# EAGLE design H2AR30 (EAGLE 9.6.2)

## Sheet 1 of 2
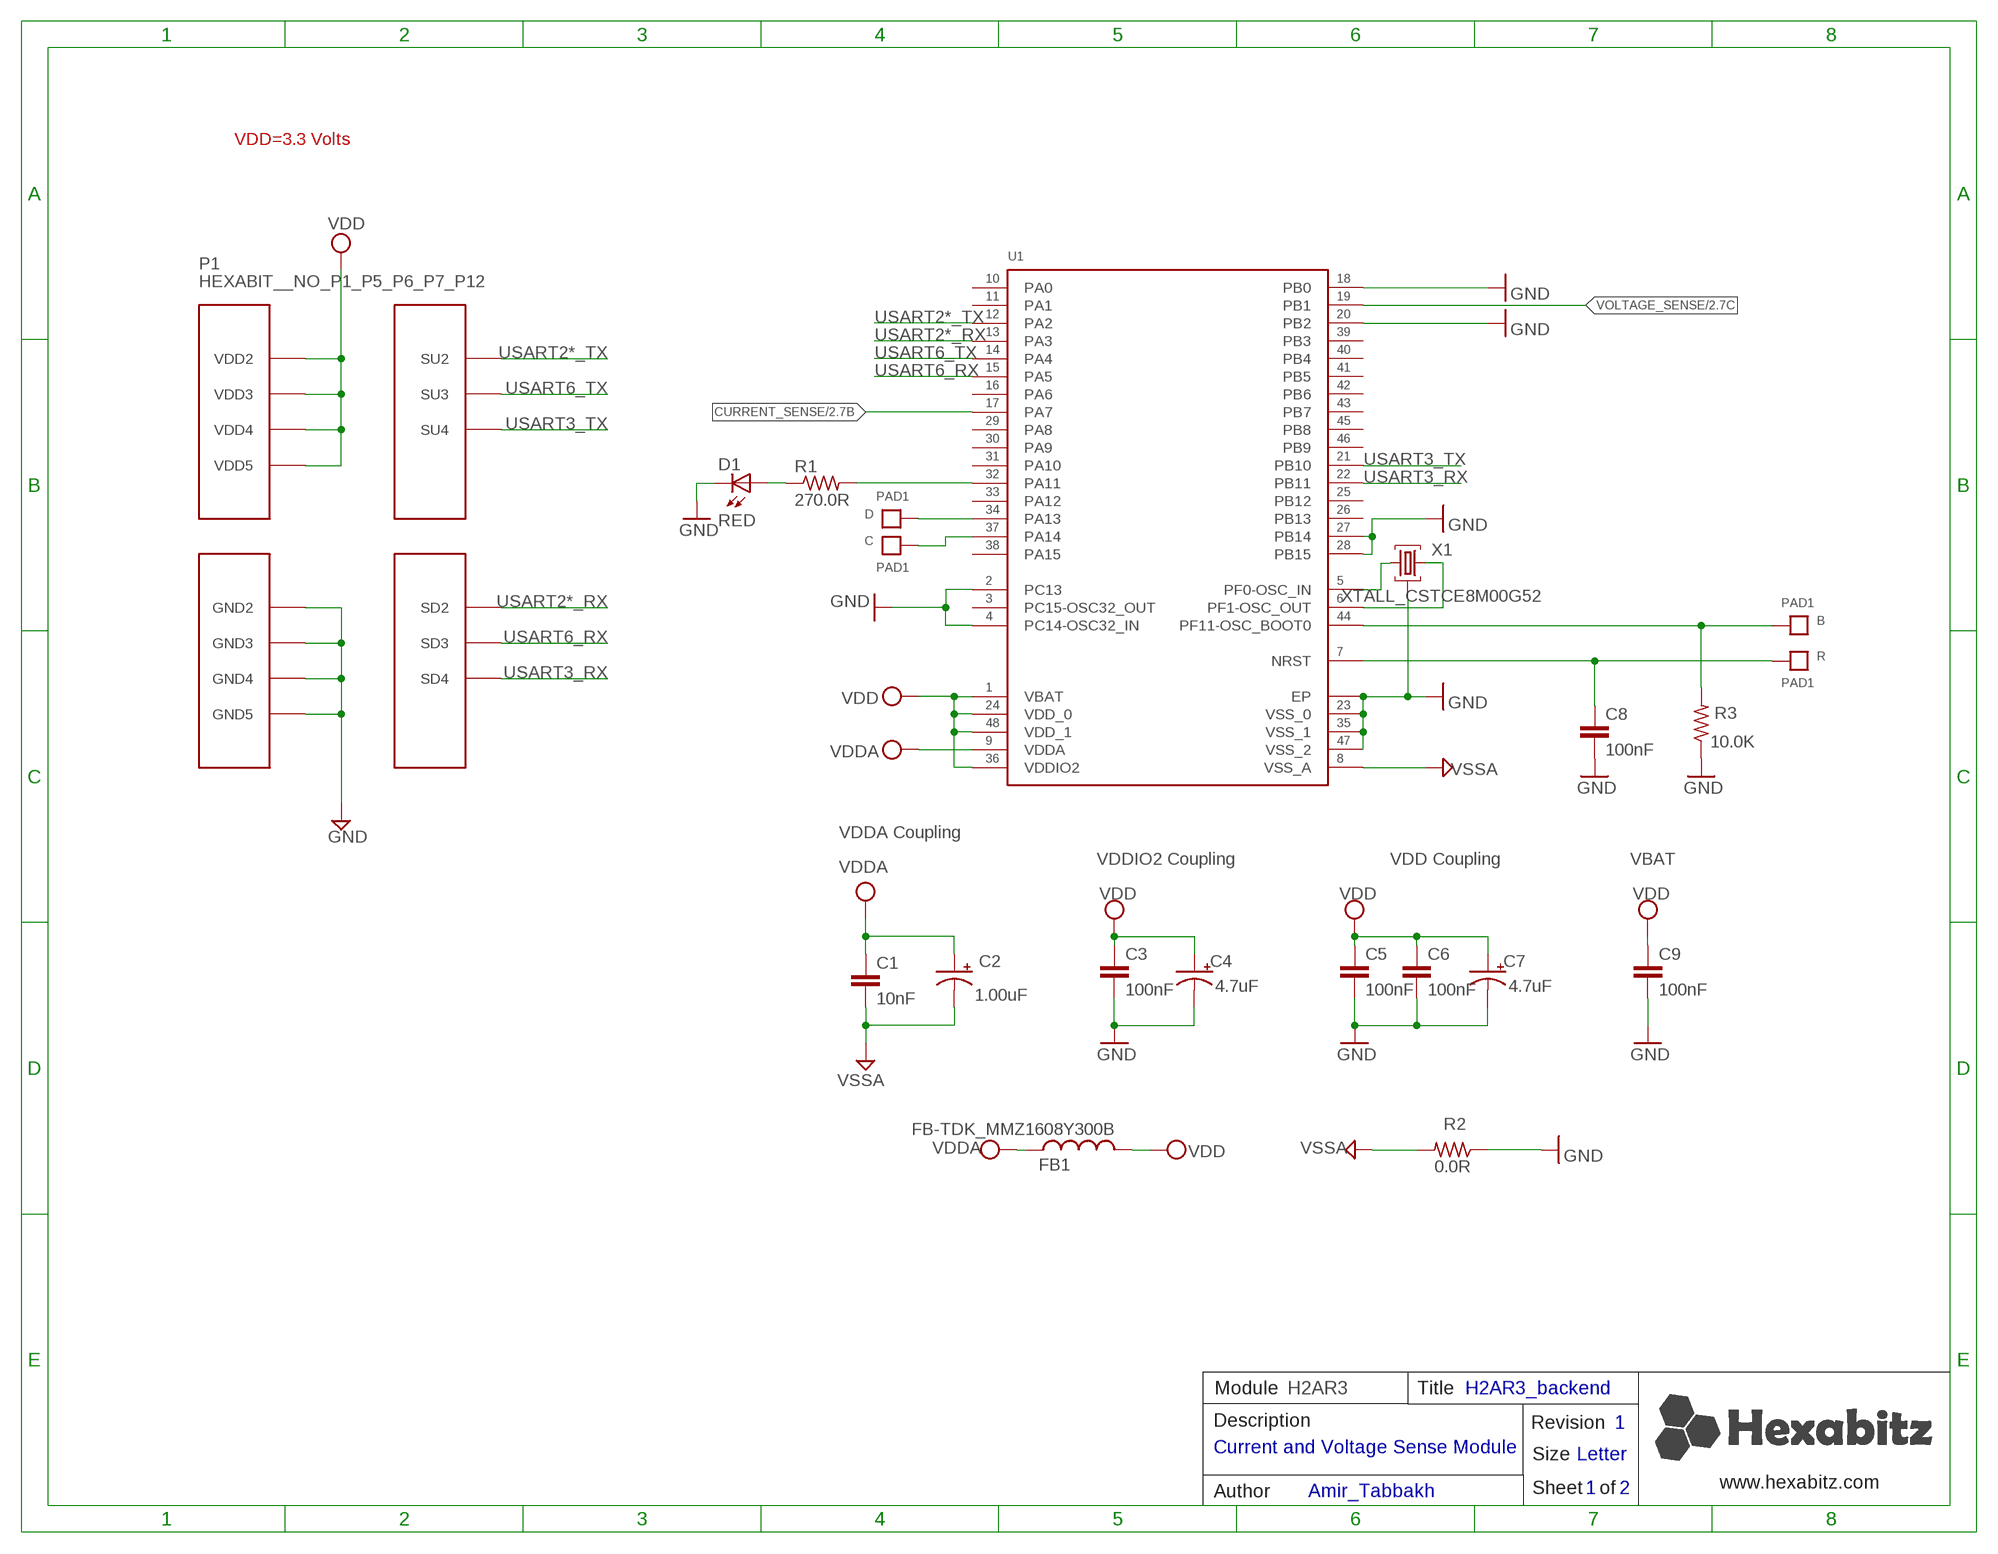
[diagram p0: schematic, sheet 1]

### Parts
B  PAD1  [PAD1]
C  PAD1  [PAD1]
C1  10nF  C-0603  [C-0603]
C2  1.00uF  C-0805-POL  [C-0805-POL]
C3  100nF  C-0603  [C-0603]
C4  4.7uF  C-0805-POL  [C-0805-POL]
C5  100nF  C-0603  [C-0603]
C6  100nF  C-0603  [C-0603]
C7  4.7uF  C-0805-POL  [C-0805-POL]
C8  100nF  C-0603  [C-0603]
C9  100nF  C-0603  [C-0603]
D  PAD1  [PAD1]
D1  RED  VLMS1300-GS08  [VLMS1300-GS08]
FB1  FB-TDK_MMZ1608Y300B  [FB-TDK_MMZ1608Y300B]
P1  HEXABIT__NO_P1_P5_P6_P7_P12  [HEXABIT_17.32_NO_P1_P6_P5_P7_P12]
R  PAD1  [PAD1]
R1  270.0R  R-0603  [R-0603]
R2  0.0R  R-0603  [R-0603]
R3  10.0K  R-0603  [R-0603]
U1  STM32F091CBU6  [STM32F091CBU6]
X1  XTALL_CSTCE8M00G52  [XTALL_CSTCE8M00G52]

### Nets
AGND: C1.2 C2.2(-) R2.2 U1.P$8(VSS_A) ; supply symbol labelled VSSA ; also sheet 2
B1: B.P$1 B.P$2 R3.2 U1.P$44(PF11-OSC_BOOT0)
CURRENT_SENSE: U1.P$17(PA7) ; also sheet 2
GND: C3.2 C4.2(-) C5.2 C6.2 C7.2(-) C8.2 C9.2 D1.C P1.PAD_PD8(GND2) P1.PAD_PD9(GND3) P1.PAD_PD10(GND4) P1.PAD_PD11(GND5) R2.1 R3.1 U1.EP U1.P$2(PC13) U1.P$3(PC14-OSC32_IN) U1.P$18(PB0) U1.P$20(PB2) U1.P$23(VSS_0) U1.P$27(PB14) U1.P$28(PB15) U1.P$35(VSS_1) U1.P$47(VSS_2) X1.P$2
N$3: R1.2 U1.P$32(PA11)
N$4: D1.A R1.1
N$5: U1.P$5(PF0-OSC_IN) X1.P$1
N$6: U1.P$6(PF1-OSC_OUT) X1.P$3
N$7: D.P$1 D.P$2 U1.P$34(PA13)
N$9: C.P$1 C.P$2 U1.P$37(PA14)
R1: C8.1 R.P$1 R.P$2 U1.P$7(NRST)
USART2*_RX: P1.PAD_PD2(SD2) U1.P$13(PA3)
USART2*_TX: P1.PAD_PU2(SU2) U1.P$12(PA2)
USART3_RX: P1.PAD_PD4(SD4) U1.P$22(PB11)
USART3_TX: P1.PAD_PU4(SU4) U1.P$21(PB10)
USART6_RX: P1.PAD_PD3(SD3) U1.P$15(PA5)
USART6_TX: P1.PAD_PU3(SU3) U1.P$14(PA4)
VCC: C1.1 C2.1(+) FB1.1 U1.P$9(VDDA) ; supply symbol labelled VDDA ; also sheet 2
VDD: C3.1 C4.1(+) C5.1 C6.1 C7.1(+) C9.1 FB1.2 P1.PAD_PU8(VDD2) P1.PAD_PU9(VDD3) P1.PAD_PU10(VDD4) P1.PAD_PU11(VDD5) U1.P$1(VBAT) U1.P$24(VDD_0) U1.P$36(VDDIO2) U1.P$48(VDD_1)
VOLTAGE_SENSE: U1.P$19(PB1) ; also sheet 2
Unconnected: U1.P$4(PC15-OSC32_OUT) U1.P$10(PA0) U1.P$11(PA1) U1.P$16(PA6) U1.P$25(PB12) U1.P$26(PB13) U1.P$29(PA8) U1.P$30(PA9) U1.P$31(PA10) U1.P$33(PA12) U1.P$38(PA15) U1.P$39(PB3) U1.P$40(PB4) U1.P$41(PB5) U1.P$42(PB6) U1.P$43(PB7) U1.P$45(PB8) U1.P$46(PB9)

### Notes on the sheet
- VDD=3.3 Volts
- VDDA Coupling
- VDDIO2 Coupling | VDD Coupling | VBAT
- Module | H2AR3 | Title | H2AR3_backend
- Description | Revision | 1
- Current and Voltage Sense Module
- Size | Letter
- www.hexabitz.com
- Author | Amir_Tabbakh | Sheet   of | 1 | 2
- C:/Users/Admin/Desktop/logodraft.bmp

## Sheet 2 of 2
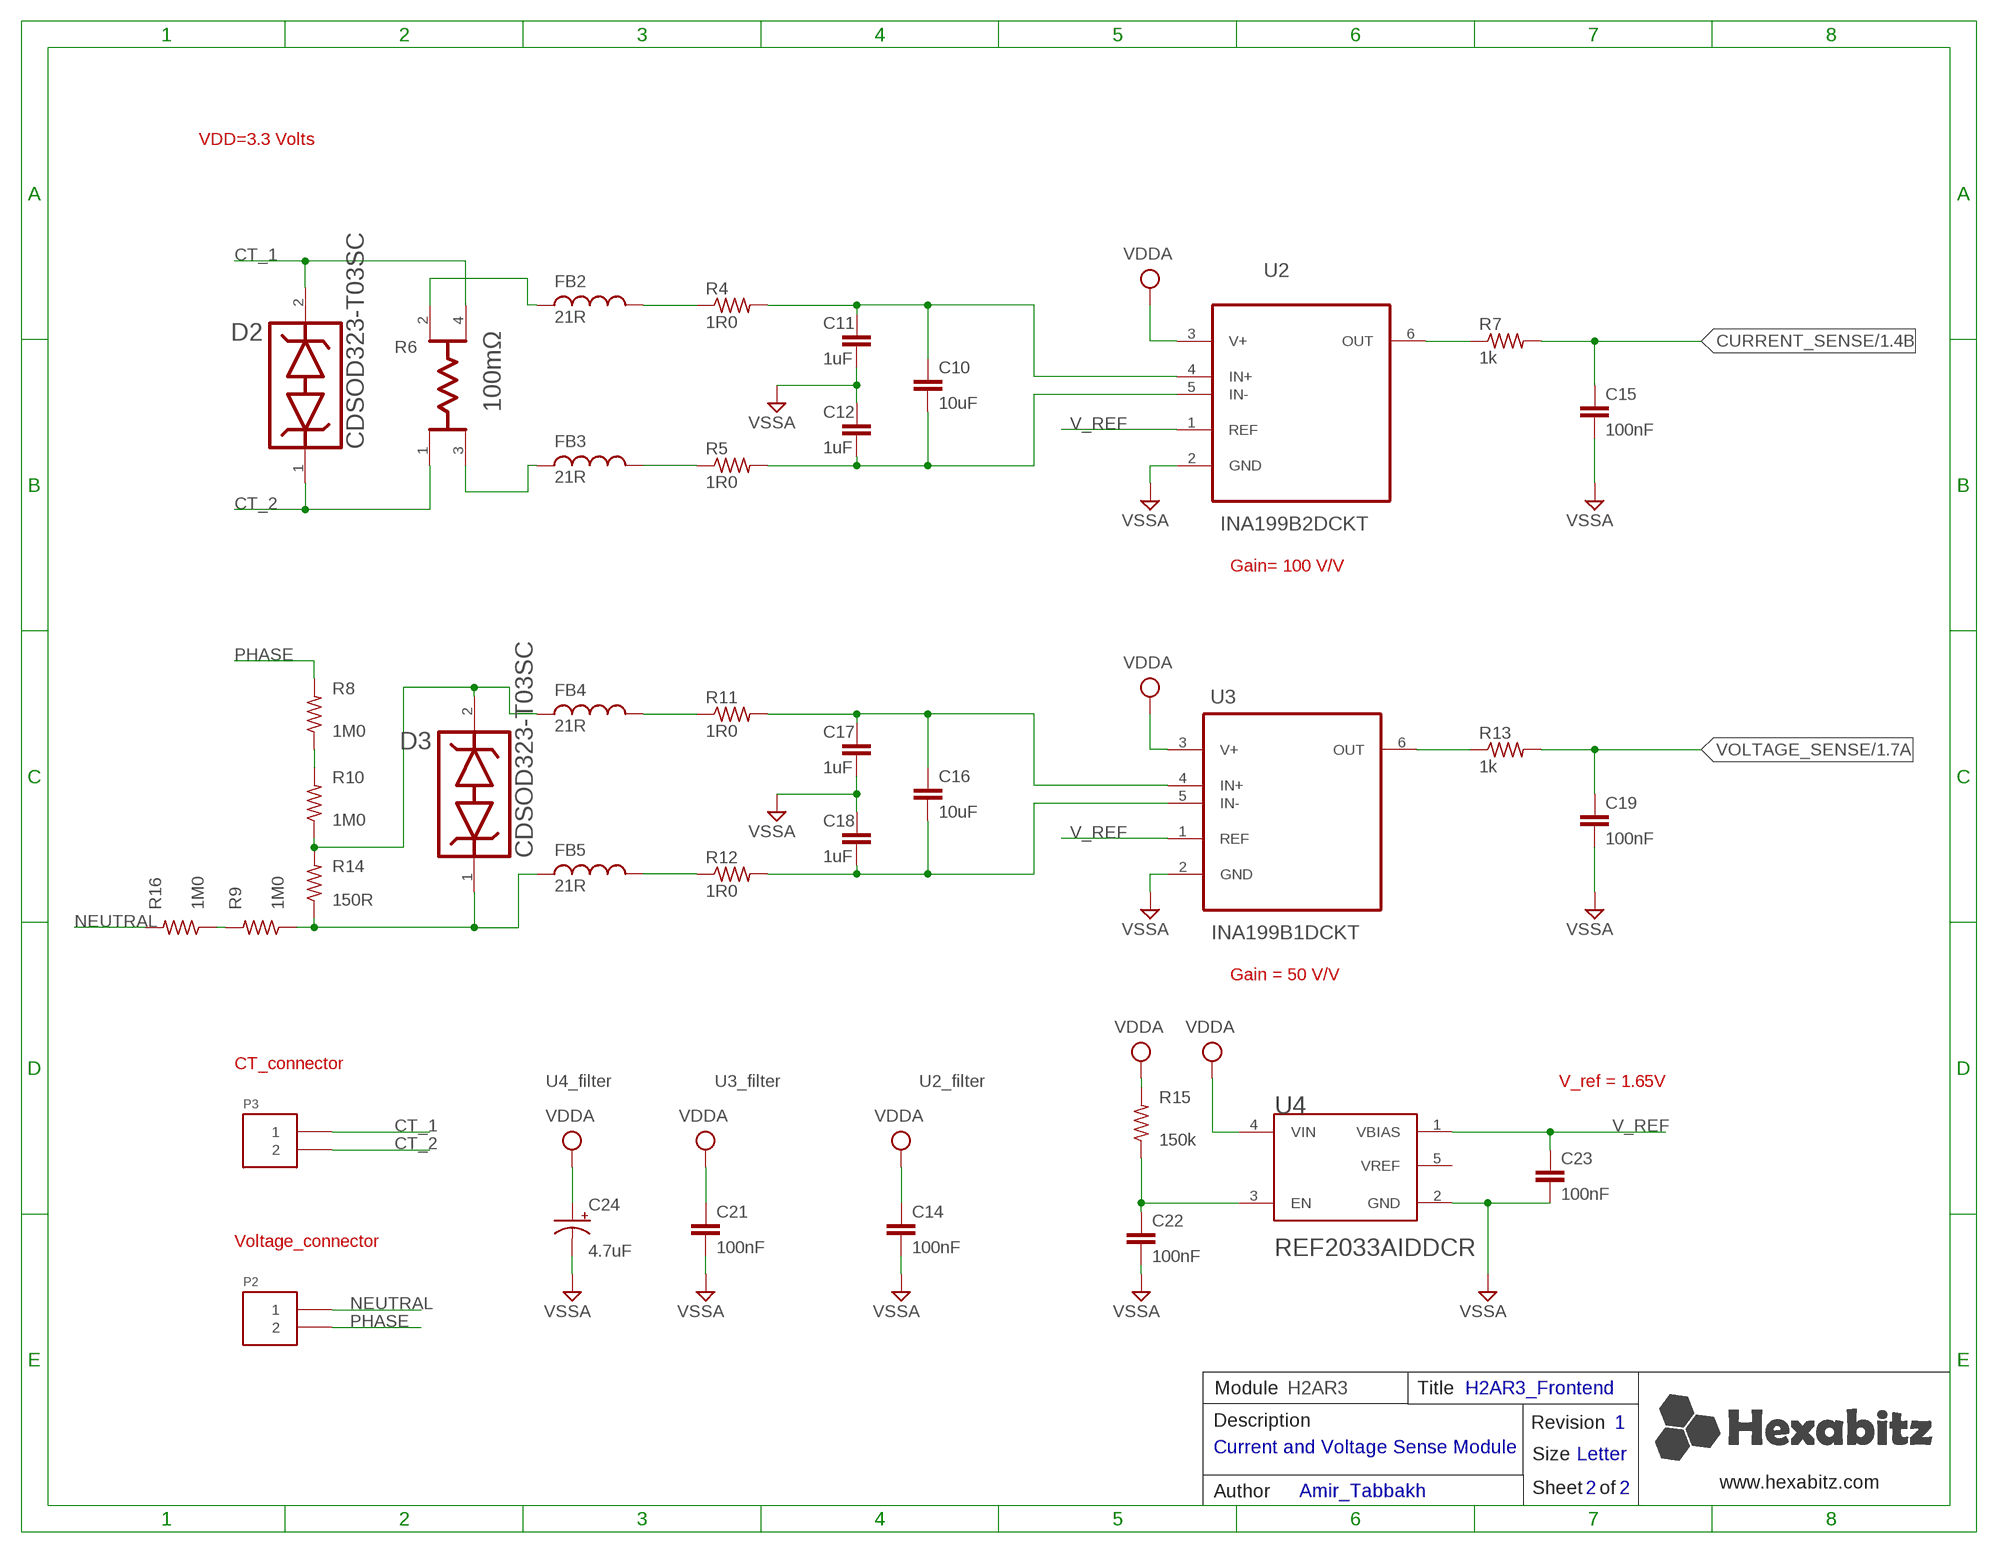
[diagram p1: schematic, sheet 2]

### Parts
C10  10uF  C-0603  [C-0603]
C11  1uF  C-0603  [C-0603]
C12  1uF  C-0603  [C-0603]
C14  100nF  C-0603  [C-0603]
C15  100nF  C-0603  [C-0603]
C16  10uF  C-0603  [C-0603]
C17  1uF  C-0603  [C-0603]
C18  1uF  C-0603  [C-0603]
C19  100nF  C-0603  [C-0603]
C21  100nF  C-0603  [C-0603]
C22  100nF  C-0603  [C-0603]
C23  100nF  C-0603  [C-0603]
C24  4.7uF  C-0805-POL  [C-0805-POL]
D2  BOURNS_CDSOD323-T03SCBOURNS_CDSOD323-T03SC_0_0  [BOURNS_CDSOD323-T03SC_0]
D3  BOURNS_CDSOD323-T03SCBOURNS_CDSOD323-T03SC_0_0  [BOURNS_CDSOD323-T03SC_0]
FB2  21R  FB-0805  [FB-0805]
FB3  21R  FB-0805  [FB-0805]
FB4  21R  FB-0805  [FB-0805]
FB5  21R  FB-0805  [FB-0805]
P2  1546111-2  [1546111-2]
P3  1546111-2  [1546111-2]
R4  1R0  R-0603  [R-0603]
R5  1R0  R-0603  [R-0603]
R6  VISHAY_Y14870R10000B9RVISHAY_Y14870R10000B9R_0_0  [VISHAY_Y14870R10000B9R_0]
R7  1k  R-0603  [R-0603]
R8  1M0  R_1206R1206  [R1206]
R9  1M0  R_1206R1206  [R1206]
R10  1M0  R_1206R1206  [R1206]
R11  1R0  R-0603  [R-0603]
R12  1R0  R-0603  [R-0603]
R13  1k  R-0603  [R-0603]
R14  150R  R_1206R1206  [R1206]
R15  150k  R-0603  [R-0603]
R16  1M0  R_1206R1206  [R1206]
U2  INA199B2DCKT  [SOT65P210X110-6N]
U3  INA199B1DCKT  [SOT65P210X110-6N]
U4  TEXAS_INSTRUMENTS_REF2033AIDDCRTEXAS_INSTRUMENTS_REF2033AIDDCR_0_2  [TEXAS_INSTRUMENTS_REF2033AIDDCR_2]

### Nets
AGND: C11.1 C12.2 C14.2 C15.2 C17.1 C18.2 C19.2 C21.2 C22.2 C23.2 C24.2(-) U2.2(GND) U3.2(GND) U4.2(GND) ; supply symbol labelled VSSA ; also sheet 1
CT_1: D2.2 P3.1 R6.4(I2)
CT_2: D2.1 P3.2 R6.1(I1)
CURRENT_N: FB2.1 R6.2(E2)
CURRENT_P: FB3.1 R6.3(E1)
CURRENT_SENSE: C15.1 R7.2 ; also sheet 1
N$2: C10.1 C11.2 R4.2 U2.4(IN+)
N$8: C10.2 C12.1 R5.2 U2.5(IN-)
N$10: R9.2 R16.1
N$11: FB2.2 R4.1
N$12: FB3.2 R5.1
N$13: R8.1 R10.2
N$15: R7.1 U2.6(OUT)
N$16: C22.1 R15.1 U4.3(EN)
N$17: C16.1 C17.2 R11.2 U3.4(IN+)
N$18: C16.2 C18.1 R12.2 U3.5(IN-)
N$19: FB4.2 R11.1
N$20: FB5.2 R12.1
N$21: D3.2 FB4.1 R10.1 R14.2
N$22: D3.1 FB5.1 R9.1 R14.1
N$23: R13.1 U3.6(OUT)
NEUTRAL: P2.1 R16.2
PHASE: P2.2 R8.2
V_REF: C23.1 U2.1(REF) U3.1(REF) U4.1(VBIAS)
VCC: C14.1 C21.1 C24.1(+) R15.2 U2.3(V+) U3.3(V+) U4.4(VIN) ; supply symbol labelled VDDA ; also sheet 1
VOLTAGE_SENSE: C19.1 R13.2 ; also sheet 1

### Notes on the sheet
- VDD=3.3 Volts
- Gain= 100 V/V
- Gain = 50 V/V
- CT_connector
- U4_filter | U3_filter | U2_filter | V_ref = 1.65V
- Voltage_connector
- Module | H2AR3 | Title | H2AR3_Frontend
- Description | Revision | 1
- Current and Voltage Sense Module
- Size | Letter
- www.hexabitz.com
- Author | Amir_Tabbakh | Sheet   of | 2 | 2

## Power pins joined to a net without a drawn wire
VREF: U4.5(VREF)

## Library data of the parts
B C D R = HEXABITZ_CONNECTION_PARTS:PAD1
C1 = HEXABITZ_RCLS:C-0603: CAP CER 10% X7R 0603; CAPACITANCE: 10nF; MFN: KEMET; MPN: C0603C103K5RACTU; OCTOPART_URL: https://octopart.com/c0603c103k5ractu-kemet-133094?r=sp&s=R_iPBxLnSmGqhkU2rIMFpg; TOLERANCE: 10%; VOLTAGE_RATING: 50V
C2 = HEXABITZ_RCLS:C-0805-POL: Cap Tant Solid SMD 2012; CAPACITANCE: 1.00uF; MFN: Yageo; MPN: CC0805KKX7R7BB105; OCTOPART_URL: https://octopart.com/cc0805kkx7r7bb105-yageo-8376555?r=sp&s=YKl1wwtkROau_X5nniH2ig; TOLERANCE: 10%; VOLTAGE_RATING: 16V
C3 C6 C8 C14 C15 C19 C21-C23 = HEXABITZ_RCLS:C-0603: CAP CER 10% X7R 0603; CAPACITANCE: 100nF; MFN: KEMET; MPN: C0603C104K8RACTU; OCTOPART_URL: https://octopart.com/c0603c104k8ractu-kemet-145075?r=sp&s=9bS9ASSwSEqMCE9KBEQZ0g; TOLERANCE: 10%; VOLTAGE_RATING: 10V
C4 C7 C24 = HEXABITZ_RCLS:C-0805-POL: Cap Tant Solid SMD 2012; CAPACITANCE: 4.7uF; MFN: Murata; MPN: GRM21BC81E475KA12L; OCTOPART_URL: https://octopart.com/grm21bc81e475ka12l-murata-10331911?r=sp&s=RY3qZSD8T6mG6TC9CHI5qQ; TOLERANCE: 10%; VOLTAGE_RATING: 25V
C5 = HEXABITZ_RCLS:C-0603: CAP CER 10% X7R 0603; CAPACITANCE: 100nF; MFN: KEMET; MPN: C0603C104K8RACTU; OCTOPART_URL: https://octopart.com/c0603c104k8ractu-kemet-145075?r=sp&s=9bS9ASSwSEqMCE9KBEQZ0g; TOLERANCE: 10%; VOLTAGE_RATING: 10
C9 = HEXABITZ_RCLS:C-0603: CAP CER 10% X7R 0603; CAPACITANCE: 100nF; MFN: KEMET; MPN: C0603C104K8RACTU; OCTOPART_URL: https://octopart.com/c0603c104k8ractu-kemet-145075?r=sp&s=9bS9ASSwSEqMCE9KBEQZ0g; TOLERANCE: 10V; VOLTAGE_RATING: 10%
C10 = HEXABITZ_RCLS:C-0603: CAP CER 10% X7R 0603; CAPACITANCE: 10uF; MFN: KEMET; MPN: C0603C106M9PACTU; OCTOPART_URL: https://octopart.com/c0603c106m9pactu-kemet-8375727?r=sp; VOLTAGE_RATING: 6.3v
C11 C12 C17 C18 = HEXABITZ_RCLS:C-0603: CAP CER 10% X7R 0603; CAPACITANCE: 1uF; MFN: KEMET; MPN: C0603C105K8RACTU; OCTOPART_URL: https://octopart.com/c0603c105k8ractu-kemet-12595642?r=sp; TOLERANCE: 10%; VOLTAGE_RATING: 10v
C16 = HEXABITZ_RCLS:C-0603: CAP CER 10% X7R 0603; CAPACITANCE: 10uF; MFN: KEMET; MPN: C0603C106M9PACTU; OCTOPART_URL: https://octopart.com/c0603c106m9pactu-kemet-8375727?r=sp; TOLERANCE: 20%; VOLTAGE_RATING: 6.3V
D1 = HEXABITZ_USER_INTERFACE_PARTS:VLMS1300-GS08: Red 0603 130° Clear 54 mcd 2 V Surface Mount ChipLED ; Octopart Url : http://octopart.com/vlms1300-gs08-vishay-21709201; MFN: Vishay; MPN: VLMS1300-GS08; OCTOPART_URL: https://octopart.com/vlms1300-gs08-vishay-21709201?r=sp&s=_gcP4_q8T1SC6PJQPTQ9yA
D2 D3 = HEXABITZ_RCLS:BOURNS_CDSOD323-T03SC: CDSOD323-TxxSC - TVS Diode Series; DESCRIPTION: Dio Tvs Vwm 03V 500W Bidir Sod323 / Tape & Reel - 7" Reel; MFN: Bourns; MPN: CDSOD323-T03SC; OCTOPART_URL: https://octopart.com/cdsod323-t03sc-bourns-10487153?r=sp
FB1 = HEXABITZ_RCLS:FB-TDK_MMZ1608Y300B: Ferrite Beads Multi-Layer 30Ohm 25% 100MHz 1.5A 50mOhm DCR 0603; MFN: TDK; MPN: MMZ1608Y300B; OCTOPART_URL: https://octopart.com/mmz1608y300b-tdk-368280?r=sp&s=cd9_2ZEqQ9q9UNBuQgHAiA
FB2-FB5 = HEXABITZ_RCLS:FB-0805: Ferrite Beads Multi-Layer 0805; MFN: Taiyo Yuden; MPN: FBMJ2125HM210NT; OCTOPART_URL: https://octopart.com/fbmj2125hm210nt-taiyo+yuden-368424?r=sp
P1 = hexabitz_connectors:HEXABIT_?_NO_P1_P5_P6_P7_P12: Hexabitz Hexagon Module Connector Hexagon side length = 18.00mm.
P2 P3 = HEXABITZ_CONNECTION_PARTS:1546111-2: Conn Shrouded Header HDR 2 POS 5.08mm Solder ST Thru-Hole; MFN: TE Connectivity; MPN: 1546111-2; OCTOPART_URL: https://octopart.com/1546111-2-te+connectivity-40393355
R1 = HEXABITZ_RCLS:R-0603: Thick Film Resistors - SMD 0603; MFN: Yageo; MPN: RC0603FR-07270RL; OCTOPART_URL: https://octopart.com/search?q=RC0603FR-07270RL&start=0; RESISTANCE: 270.0 Ohm; TOLERANCE: 5%
R2 = HEXABITZ_RCLS:R-0603: Thick Film Resistors - SMD 0603; MFN: Yageo; MPN: RC0603JR-070RL; OCTOPART_URL: https://octopart.com/rc0603jr-070rl-yageo-1241539?r=sp&s=X2NteqRjRNWrnx42Y0aliA; RESISTANCE: 0.0 Ohm
R3 = HEXABITZ_RCLS:R-0603: Thick Film Resistors - SMD 0603; MFN: Yageo; MPN: RC0603JR-0710KL; OCTOPART_URL: https://octopart.com/search?q=RC0603JR-0710KL&start=0; RESISTANCE: 10.0K Ohm; TOLERANCE: 5%
R4 R5 R11 R12 = HEXABITZ_RCLS:R-0603: Thick Film Resistors - SMD 0603; MFN: Vishay; MPN: CRCW06031R00FKEA; OCTOPART_URL: https://octopart.com/crcw06031r00fkea-vishay-39713722?r=sp&s=biXSlGylTBiwPOCcABx_kA; RESISTANCE: 1; TOLERANCE: 1%
R6 = HEXABITZ_RCLS:VISHAY_Y14870R10000B9R: RES 0.1 OHM 0.1% 1W 2512; DESCRIPTION: Res Metal Strip 2512 100m Ohm 0.1% 1W ±15ppm/°C Molded SMD T/R; MFN: Vishay Precision Group; MPN: Y14870R10000B9R; OCTOPART_URL: https://octopart.com/y14870r10000b9r-vishay+precision+group-20188347?r=sp; POWER_RATING: 1W; RESISTANCE: 100mΩ
R7 R13 = HEXABITZ_RCLS:R-0603: Thick Film Resistors - SMD 0603; MFN: Yageo; MPN: RC0603JR-071KL; OCTOPART_URL: https://octopart.com/rc0603jr-071kl-yageo-55402888?r=sp; RESISTANCE: 1K; TOLERANCE: 5%
R8-R10 R16 = HEXABITZ_RCLS:R_1206: RESISTOR, American symbol; MFN: Yageo; MPN: RT1206BRD071ML; OCTOPART_URL: https://octopart.com/rt1206brd071ml-yageo-1262221?r=sp
R14 = HEXABITZ_RCLS:R_1206: RESISTOR, American symbol; MFN: Panasonic; MPN: ERA-8AEB151V; OCTOPART_URL: https://octopart.com/era-8aeb151v-panasonic-55477439?r=sp
R15 = HEXABITZ_RCLS:R-0603: Thick Film Resistors - SMD 0603; MFN: Vishay; MPN: CRCW0603150KFKEA; OCTOPART_URL: https://octopart.com/crcw0603150kfkea-vishay-39455816?r=sp; RESISTANCE: 150K; TOLERANCE: 1%
U1 = HEXABITZ_ICs:STM32F091CBU6: Description : ARM-based 32-bit MCU, CAN, 12 timers, ADC, DAC & Comm. Interface, 2 to 3.6 V, -40 to 85 degC, 48-Pin UFQFPN, RoHS, Tray ;Parameter : Ciiva URL : https://ciiva.com/part/STM32F091CBU6-20240708, CiivaID : 20240708, Clock Speed : 48000000.0 Hz, Lifecycle Status : Active, Mounting Style : Surface Mount, Number of Pins : 48, Octopart Url : https://octopart.com/stm32f091cbu6-stmicroelectronics-51988677, OctopartID : 5f4f955c32ec8088, RAM Memory Size : 32768 B, REACH SVHC Compliance : No SVHC, RoHS : Compliant,; MFN: STMicroelectronics; MPN: STM32F091CBU6; OCTOPART_URL: https://octopart.com/stm32f091cbu6-stmicroelectronics-51988677?r=sp&s=bU6fpgsrTZOxHyt7jkfh3w
U2 = HEXABITZ_ICs:INA199B2DCKT: CURRENT SHUNT MONITOR; DESCRIPTION: 26V, bi-directional current sense amplifier 6-SC70 -40 to 125; MFN: Texas Instruments; MPN: INA199B2DCKT; OCTOPART_URL: https://octopart.com/ina199b2dckt-texas+instruments-24258237?r=sp
U3 = HEXABITZ_ICs:INA199B1DCKT: CURRENT SHUNT MONITOR; DESCRIPTION: 26V, bi-directional current sense amplifier 6-SC70 -40 to 125; MFN: Texas Instruments; MPN: INA199B1DCKT; OCTOPART_URL: https://octopart.com/ina199b1dckt-texas+instruments-24258235?r=sp
U4 = HEXABITZ_ICs:TEXAS_INSTRUMENTS_REF2033AIDDCR: V-Ref Precision 3.3V 20mA 5-Pin TSOT-23 T/R; DESCRIPTION: Low-Drift, Low-Power, Dual-Output Vref and Vref/2 Voltage Reference 5-SOT-23-THIN -40 to 125; MFN: Texas Instruments; MPN: REF2033AIDDCR; OCTOPART_URL: https://octopart.com/ref2033aiddcr-texas+instruments-46921199?r=sp; OUTPUT_VOLTAGE: 1.65/3.3V
X1 = HEXABITZ_OTHER_PARTS:XTALL_CSTCE8M00G52: MURATA CSTCE8M00G52-R0 RESONATOR, SMD, 8MHZ ; Octopart Url : https://octopart.com/cstce8m00g52-r0-murata-7145559; MFN: Murata; MPN: CSTCE8M00G52Z-R0; OCTOPART_URL: https://octopart.com/cstce8m00g52z-r0-murata-17755941?r=sp&s=JDnNJnrHQhyS8Zk4ofFWXw

## Net classes
0 default: clearance 0.205 mm

## Board
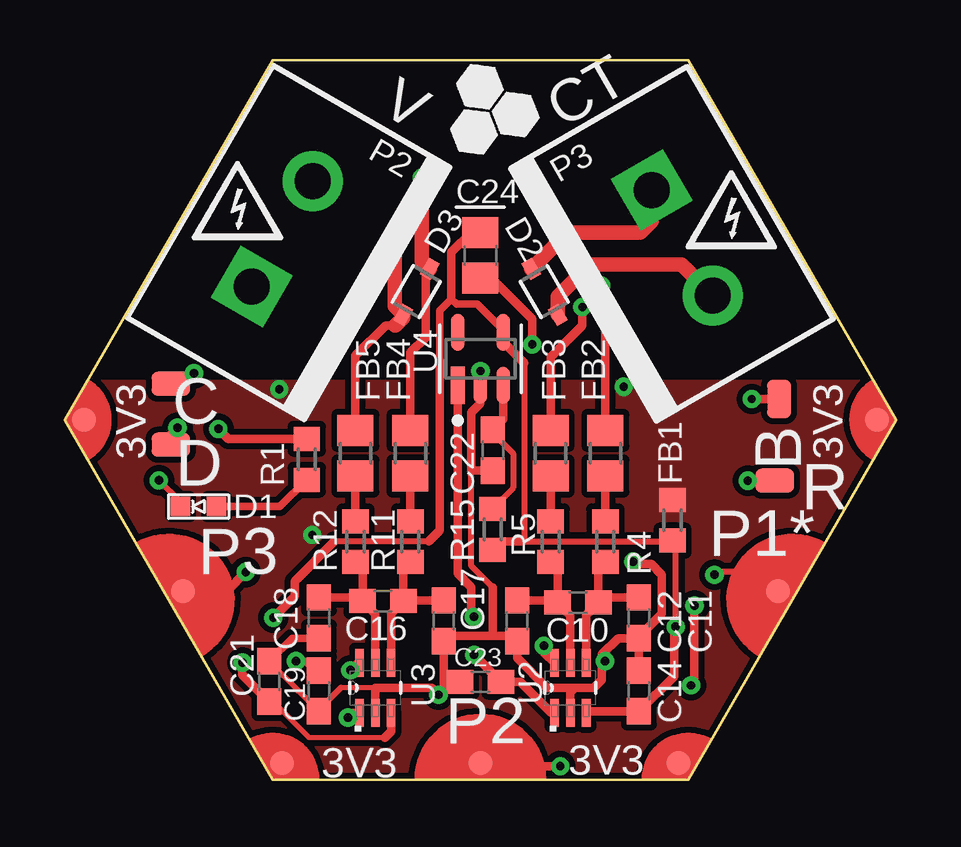
[diagram p2: board, top side]
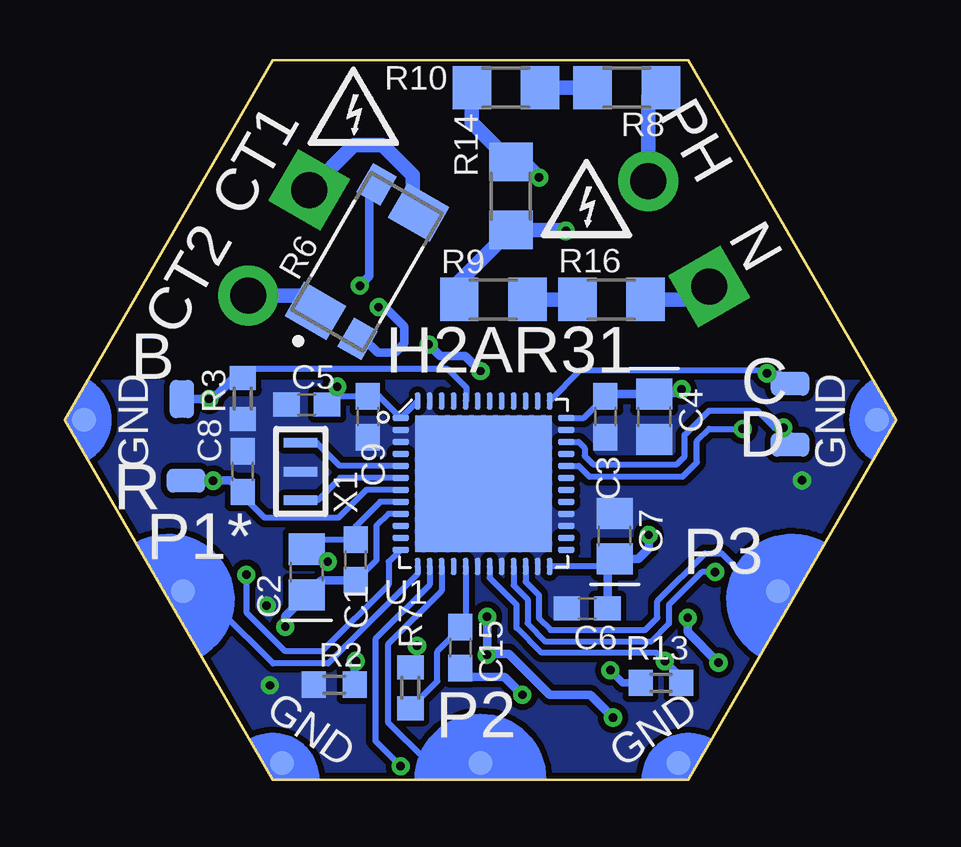
[diagram p3: board, bottom side, seen from below]

Size 34.64 x 30 mm. Coordinates in mm from the lower left corner, seen from the top.
Copper layers (1*16): Top 0.035mm / dielectric 1.5mm / Bottom 0.035mm
Design rules "H2AR30": minimum track width 7mil, minimum drill 10mil, track to track 6mil, track to pad 6mil, pad to pad 6mil, via to via 6mil, smd to smd 0mil, copper to edge 1mil, drill to drill 8mil, minimum pad ring 10mil, minimum via ring 8mil, stop-mask expansion 2mil, vias tented up to drill 15mil, thermal gap 10mil

### Footprints (pad centres in the part's own frame; a part is rotated, then mirrored left to right if it is on the bottom)
PAD1 = smd 1.6 x 1: P$1 0,0 | smd 1.6 x 1 bottom: P$2 0,0
C-0603 = smd 1.1 x 1: 1 -0.85,0; 2 0.85,0
C-0805-POL = smd 1.3 x 1.5: 1 -0.95,0; 2 0.95,0
VLMS1300-GS08 = smd 0.8 x 0.8: A 0,0.75; C 0,-0.75
BOURNS_CDSOD323-T03SC_0 = smd 0.8 x 0.5: 1 -1.1,0; 2 1.1,0
FB-TDK_MMZ1608Y300B = smd 1 x 1.1: 1 -0.85,0; 2 0.85,0
FB-0805 = smd 1.3 x 1.5: 1 -0.95,0; 2 0.95,0
HEXABIT_17.32_NO_P1_P6_P5_P7_P12 = smd 1 x 1 bottom: PAD_PD2 12.39,-7.15; PAD_PD3 0,-14.31; PAD_PD4 -12.39,-7.15; PAD_PD8 16.52,0; PAD_PD9 8.26,-14.31; PAD_PD10 -8.26,-14.31; PAD_PD11 -16.52,0 | smd 1 x 1: PAD_PU2 12.39,-7.15; PAD_PU3 0,-14.31; PAD_PU4 -12.39,-7.15; PAD_PU8 16.52,0; PAD_PU9 8.26,-14.31; PAD_PU10 -8.26,-14.31; PAD_PU11 -16.52,0
1546111-2 = drill 1.5 pad 2.5 square: 1 -2.54,0 | drill 1.5 pad 2.5: 2 2.54,0
R-0603 = smd 1 x 1.1: 1 -0.85,0; 2 0.85,0
VISHAY_Y14870R10000B9R_0 = smd 1.65 x 2.01: 1 -2.855,0.835; 4 2.855,-0.835 | smd 1.39 x 1.14: 2 2.985,1.27; 3 -2.985,-1.27
R1206 = smd 1.6 x 1.803: 1 -1.422,0; 2 1.422,0
STM32F091CBU6 = smd 5.7 x 5.7: EP 0,0 | smd 0.25 x 0.7: P$1 -2.75,-3.45; P$2 -2.25,-3.45; P$3 -1.75,-3.45; P$4 -1.25,-3.45; P$5 -0.75,-3.45; P$6 -0.25,-3.45; P$7 0.25,-3.45; P$8 0.75,-3.45; P$9 1.25,-3.45; P$10 1.75,-3.45; P$11 2.25,-3.45; P$12 2.75,-3.45; P$25 2.75,3.45; P$26 2.25,3.45; P$27 1.75,3.45; P$28 1.25,3.45; P$29 0.75,3.45; P$30 0.25,3.45; P$31 -0.25,3.45; P$32 -0.75,3.45; P$33 -1.25,3.45; P$34 -1.75,3.45; P$35 -2.25,3.45; P$36 -2.75,3.45 | smd 0.7 x 0.25: P$13 3.45,-2.75; P$14 3.45,-2.25; P$15 3.45,-1.75; P$16 3.45,-1.25; P$17 3.45,-0.75; P$18 3.45,-0.25; P$19 3.45,0.25; P$20 3.45,0.75; P$21 3.45,1.25; P$22 3.45,1.75; P$23 3.45,2.25; P$24 3.45,2.75; P$37 -3.45,2.75; P$38 -3.45,2.25; P$39 -3.45,1.75; P$40 -3.45,1.25; P$41 -3.45,0.75; P$42 -3.45,0.25; P$43 -3.45,-0.25; P$44 -3.45,-0.75; P$45 -3.45,-1.25; P$46 -3.45,-1.75; P$47 -3.45,-2.25; P$48 -3.45,-2.75
SOT65P210X110-6N = smd 1.168 x 0.356: 1 -1.041,0.66; 2 -1.041,0; 3 -1.041,-0.66; 4 1.041,-0.66; 5 1.041,0; 6 1.041,0.66
TEXAS_INSTRUMENTS_REF2033AIDDCR_2 = smd 1.554 x 0.572: 1 -1.1,0.95; 2 -1.1,0; 3 -1.1,-0.95; 4 1.1,-0.95; 5 1.1,0.95
XTALL_CSTCE8M00G52 = smd 1.4 x 0.4: P$1 0,1.2; P$2 0,0; P$3 0,-1.2

### Placement (x,y rotation side)
B  29.77,15.86 90 top
C  4.42,16.5 0 top
C1  22.53,9.16 90 bottom
C2  24.56,8.65 90 bottom
C3  12.11,15.13 270 bottom
C4  10.08,15.13 270 bottom
C5  24.56,15.63 180 bottom
C6  12.88,7.13 180 bottom
C7  11.73,10.15 90 bottom
C8  27.23,12.84 90 bottom
C9  22.02,15.13 270 bottom
C10  21.38,7.38 180 top
C11  23.92,6.75 90 top
C12  18.84,6.62 270 top
C14  23.92,3.7 90 top
C15  18.16,5.5 270 bottom
C16  13.26,7.44 180 top
C17  15.8,6.62 90 top
C18  10.59,6.75 270 top
C19  10.59,3.7 270 top
C21  8.53,4.09 90 top
C22  17.83,13.73 270 top
C23  17.32,4.08 180 top
C24  17.32,21.86 270 top
D  4.42,13.96 180 top
D1  5.57,11.38 270 top
D2  19.99,20.33 120 top
D3  14.65,20.33 60 top
FB1  25.32,10.81 90 top
FB2  22.53,13.6 270 top
FB3  20.24,13.6 270 top
FB4  14.4,13.6 270 top
FB5  12.11,13.6 270 top
P1  17.32,15 0 top
P2  9.07,22.75 60 top
P3  25.73,22.38 300 top
R  29.59,12.46 0 top
R1  10.08,13.35 90 top
R2  23.42,3.95 0 bottom
R3  27.23,15.89 90 bottom
R4  22.53,9.92 270 top
R5  20.24,9.92 270 top
R6  22.04,21.59 60 bottom
R7  20.24,3.82 270 bottom
R8  11.22,28.84 0 bottom
R9  16.78,20.02 0 bottom
R10  16.25,28.84 0 bottom
R11  14.4,9.92 270 top
R12  12.11,9.92 270 top
R13  9.8,4.03 0 bottom
R14  16.05,24.33 90 bottom
R15  17.83,10.43 270 top
R16  11.86,20.02 0 bottom
U1  17.19,12.33 270 bottom
U2  21.07,3.82 90 top
U3  12.94,3.82 90 top
U4  17.32,17.54 90 top
X1  24.81,12.84 0 bottom

### Tracks (layer width: path | path; a pad name or v marks a point on that pad's centre or on a via)
AGND  (via drill 0.35)
  Top 0.203: 12.94,3.82 11.51,3.82 | 8.53,4.9 9.74,3.69
  Top 0.254: 17.83,8.02 16.94,8.9 16.94,12.88 | 9.74,3.69 C19.2 10.59,2.91 11.51,3.82
  Top 0.305: C21.2 9.48,5.89 C18.2
  Top 0.356: C21.2 8.53,4.9 | U3.2 12.94,3.82 15.28,3.82 v15.57,3.53 15.8,3.75 15.8,4.21 | C11.1 23.05,5.89 22.38,5.22 22.38,4.94 | 22.38,4.94 22.38,4.16 22.04,3.82 21.26,3.82 | 17.83,5.99 16.02,5.99 C17.1 15.8,4.21 | 17.83,5.99 18.62,5.99 C12.2 18.84,5.07 20.09,3.82 21.26,3.82 | 17.83,5.99 17.83,8.02 | C24.2 17.76,20.91 19.48,19.19 v19.48,18.14 | v17.32,17.03 U4.2 17.32,15.68 16.94,15.3 16.94,12.88 C22.2 | v22.51,4.94 22.38,4.94 | C14.2 C11.1 | C11.1 23.92,5.95 24.88,6.91 24.88,8.54 24.43,8.98 23.78,8.98 v23.68,9.08 | 21.26,3.82 21.07,3.63 U2.2 | 15.8,4.21 15.92,4.08 C23.2
  Bottom 0.254: U1.P$8 21.5,11.58 22.53,10.55 C1.2 24.15,10.01 C2.2
  Bottom 0.356: v19.48,18.14 19,17.67 17.95,17.67 v17.32,17.03 | v22.51,4.94 22.57,4.89 R2.2 | v23.68,9.08 24.2,9.6 C2.2 | C15.2 17.79,4.28 16.33,4.28 v15.57,3.53
B1  (via drill 0.35)
  Top 0.356: B.P$1 v28.62,15.86
  Bottom 0.254: U1.P$44 17.91,15.81 17.91,16.34 18.68,17.11 26.86,17.11 R3.2
  Bottom 0.356: B.P$1 v28.62,15.86 28.48,15.86 27.61,16.74 R3.2
CT_1
  Top 0.61: P3.1 24.46,23.28 23.99,22.81 20.96,22.81 D2.2
  Bottom 0.61: R6.4 20.15,23.9 20.15,25.19 21.4,26.44 22.6,26.44 P3.1
CT_2
  Top 0.61: P3.2 25.71,21.48 21.87,21.48 20.54,20.14 D2.1
  Bottom 0.61: R6.1 24.84,20.18 P3.2
CURRENT_N  (via drill 0.35)
  Top 0.356: FB2.1 22.53,20.46 22.4,20.59 v22.35,20.59
  Bottom 0.356: R6.2 21.95,24.52 21.95,20.99 v22.35,20.59
CURRENT_P  (via drill 0.35)
  Top 0.356: v21.56,19.7 21.56,18.94 20.24,17.61 FB3.1
  Bottom 0.356: R6.3 22.18,18.37 21.61,17.79 20.88,17.79 20.49,18.17 20.49,18.88 21.31,19.7 v21.56,19.7
CURRENT_SENSE
  Bottom 0.254: U1.P$17 17.94,6.57 C15.1 18.16,6.3 19.12,5.34 19.12,4.1 R7.2
GND  (via drill 0.35)
  Top 0.254: v3.92,12.48 4.82,11.57 D1.C
  Top 0.356: v26.23,7.25 26.22,7.24 26.22,4.05 v26.09,3.93
  pour Bottom (isolate 0.254, no thermals): 8.61,-0.05 25.93,-0.05 34.59,14.95 33.63,16.61 0.91,16.61 -0.05,14.95
N$2
  Top 0.356: C10.1 22.23,8.78 R4.2 | C10.1 21.73,6.87 U2.4 | C11.2 22.45,7.59 C10.1
N$3  (via drill 0.35)
  Top 0.356: R1.2 6.82,14.2 v6.4,14.62
  Bottom 0.254: U1.P$32 13.23,13.08 12.78,12.63 8.9,12.63 8.3,13.22 8.3,14.11 7.8,14.62 v6.4,14.62
N$4
  Top 0.305: D1.A 8.96,11.38 R1.1
N$5
  Bottom 0.254: X1.P$1 24.14,14.04 23.18,13.08 U1.P$5
N$6
  Bottom 0.254: U1.P$6 23.17,12.58 24.11,11.64 X1.P$3
N$7  (via drill 0.35)
  Top 0.356: v4.7,14.67 4.42,14.39 D.P$1
  Bottom 0.254: U1.P$34 13.23,14.08 12.98,13.83 12.98,13.5 12.62,13.15 9.14,13.15 8.81,13.48 8.81,14.37 7.8,15.38 5.79,15.38 5.08,14.67 v4.7,14.67 4.42,14.39 D.P$1
N$8
  Top 0.356: C10.2 20.53,8.78 R5.2 | C10.2 21.07,6.85 U2.5 | C12.1 20.45,7.47 C10.2
N$9  (via drill 0.35)
  Top 0.356: v5.38,16.94 4.95,16.5 C.P$1
  Bottom 0.254: U1.P$37 13.16,17.06 5.64,17.06 5.51,16.94 | C.P$1 4.86,16.94 v5.38,16.94
  Bottom 0.356: 5.51,16.94 v5.38,16.94
N$10
  Bottom 0.61: R16.1 R9.2
N$11
  Top 0.356: FB2.2 R4.1
N$12
  Top 0.356: R5.1 FB3.2
N$13
  Bottom 0.61: R10.2 R8.1
N$15  (via drill 0.35)
  Top 0.356: v19.96,5.58 19.96,5.31 U2.6
  Bottom 0.254: R7.1 19.96,4.95 v19.96,5.58
N$16
  Top 0.254: C22.1 17.83,14.45 18.68,13.6 18.68,12.16 17.81,11.29 R15.1
  Top 0.356: U4.3 18.27,15.02 C22.1
N$17
  Top 0.356: U3.4 13.6,6.94 C16.1 | C16.1 14.11,8.78 R11.2 | C17.2 14.13,7.47 C16.1
N$18
  Top 0.356: U3.5 12.94,6.91 C16.2 | C16.2 12.41,8.78 R12.2 | C18.1 12.25,7.59 C16.2
N$19
  Top 0.356: R11.1 FB4.2
N$20
  Top 0.356: R12.1 FB5.2
N$21  (via drill 0.35)
  Top 0.356: FB4.1 14.4,17.79 15.03,18.43 15.03,21.12 D3.2
  Top 0.61: v14.88,25.1 14.88,21.61 D3.2
  Bottom 0.61: R10.1 17.68,27.38 R14.2 15.54,25.76 v14.88,25.1
N$22  (via drill 0.35)
  Top 0.356: FB5.1 12.11,17.67 13.36,18.92 13.76,18.92
  Top 0.61: v13.76,22.87 13.74,22.85 13.74,19.74 D3.1 14.1,19.26 13.76,18.92
  Bottom 0.61: R9.1 18.2,20.76 R14.1 13.8,22.91 v13.76,22.87
N$23  (via drill 0.35)
  Top 0.356: U3.6 12.22,4.87 v11.91,4.55
  Bottom 0.305: R13.1 11.38,4.03 v11.91,4.55
NEUTRAL
  Bottom 0.61: R16.2 8.33,20.02 P2.1
PHASE
  Bottom 0.61: P2.2 10.34,28.47 R8.2
R1  (via drill 0.35)
  Top 0.356: v28.46,12.46 R.P$1
  Bottom 0.254: 27.23,11.82 26.31,10.91 23.25,10.91 22.08,12.08 U1.P$7
  Bottom 0.356: R.P$1 v28.46,12.46 27.7,12.46 C8.1 27.23,11.82
USART2*_RX
  Bottom 0.254: U1.P$13 19.94,8.57 23.67,4.84 25.96,4.84 28.18,7.06
  Bottom 0.356: 28.18,7.06 28.97,7.85 P1.PAD_PD2
USART2*_TX  (via drill 0.35)
  Top 0.254: 28.75,8.66 27.2,8.66 v27.07,8.54
  Top 0.356: 28.75,8.66 28.9,8.66 P1.PAD_PU2
  Bottom 0.254: U1.P$12 21.15,9.07 21.15,8.12 23.92,5.35 25.45,5.35 27.07,6.97 v27.07,8.54
USART3_RX
  Bottom 0.254: U1.P$22 15.44,8.25 14.88,7.69 14.88,6.72 14.4,6.24 10.46,6.24 9.95,6.75 9.95,7.44 7.96,9.44 7.28,9.44 5.69,7.85 P1.PAD_PD4
USART3_TX  (via drill 0.35)
  Top 0.356: v7.54,8.65 6.74,7.85 P1.PAD_PU4
  Bottom 0.254: U1.P$21 15.94,8.1 15.36,7.51 15.36,6.51 14.59,5.75 10.21,5.75 9.47,6.49 9.47,7.27 8.09,8.65 v7.54,8.65
USART6_RX
  Bottom 0.254: 19.59,0.8 21.18,2.39 21.18,5.63 18.94,7.87 U1.P$15
  Bottom 0.356: 19.59,0.8 17.43,0.8 P1.PAD_PD3
USART6_TX  (via drill 0.35)
  Top 0.356: v20.65,0.55 19.86,0.55 17.45,0.55 P1.PAD_PU3
  Bottom 0.254: U1.P$14 19.44,8.12 21.7,5.86 21.7,1.61 v20.65,0.55
V_REF  (via drill 0.35)
  Top 0.356: U4.1 16.37,8.58 16.94,8.02 16.94,6.89 v17.04,6.79 | U3.1 12,2.78 v11.8,2.59 | v17.05,5.2 v17.05,5.19 C23.1 18.98,4.08 20.28,2.78 U2.1
  Bottom 0.356: v11.8,2.59 12.75,3.54 14.44,3.54 16.14,5.24 17.02,5.24 v17.05,5.2 17.04,5.22 v17.04,6.79
VCC  (via drill 0.35)
  Top 0.203: 13.34,1.74 10.18,1.74 8.68,3.24 C21.1
  Top 0.254: 15.16,9.92 11.22,9.92 | 19.15,17.36 19.15,9.92 | 19.1,9.92 19.15,9.92 | 19.15,9.92 25.28,9.92 FB1.1 25.45,9.83 v25.45,6.37
  Top 0.305: U4.4 18.27,18.75 17.19,19.83 16.32,19.83 16.11,20.04 15.63,19.55 15.63,17.48
  Top 0.356: 15.16,9.92 15.63,10.39 15.63,17.48 | 11.22,9.92 9.57,8.27 9.57,7.63 v8.68,6.75 | v7.4,4.88 7.4,4.37 C21.1 | U3.3 13.6,2.01 13.34,1.74 | 19.15,17.36 18.27,18.24 U4.4 | v25.45,6.37 25.39,6.3 25.39,4.31 C14.1 21.79,2.85 U2.3 | R15.2 18.17,9.92 19.1,9.92 | C24.1 16.94,22.81 16.11,21.98 16.11,20.04
  Bottom 0.254: U1.P$9 21.15,11.08 21.66,10.57 21.66,9.14 22.49,8.31 C1.1
  Bottom 0.356: C1.1 23.95,8.31 C2.1 25.45,6.81 v25.45,6.37 | v8.68,6.75 8.68,6.16 v7.4,4.88
VDD  (via drill 0.35)
  Bottom 0.254: 12.03,8.88 U1.P$24 | U1.P$36 13.01,15.08 C3.1 | U1.P$48 U1.P$1 21.54,15.98 C9.1 23.37,15.98 C5.1 23.29,16.05 v23.29,16.37 | C4.1 9.13,16.08 v8.94,16.27
  Bottom 0.356: C4.1 12.01,16.08 C3.1 | v10.31,10.2 10.31,9.63 10.74,9.2 C7.1 | C7.1 11.73,9.18 12.03,8.88 | C7.1 12.03,8.91 C6.1
  pour Top (isolate 0.254, no thermals): 8.61,-0.05 25.93,-0.05 34.59,14.95 33.63,16.61 0.91,16.61 -0.05,14.95
VOLTAGE_SENSE  (via drill 0.35)
  Top 0.305: C19.1 10.42,4.55 10.03,4.94 v9.64,4.94
  Bottom 0.254: v9.64,4.94 9.99,5.29 14.78,5.29 15.82,6.32 15.82,7.28 16.94,8.41 U1.P$19
  Bottom 0.305: R13.2 8.95,4.27 9.61,4.94 v9.64,4.94

### Text on the board
tPlace: V | CT | 3V3 | 3V3 | P1* | P3 | P2 | 3V3 | 3V3
bPlace: CT1 | PH | CT2 | N | H2AR31 | GND | GND | P1* | P3 | GND | P2 | GND
bNames: B | C | D | R